# EAGLE schematic busIsolator (EAGLE 4.16)
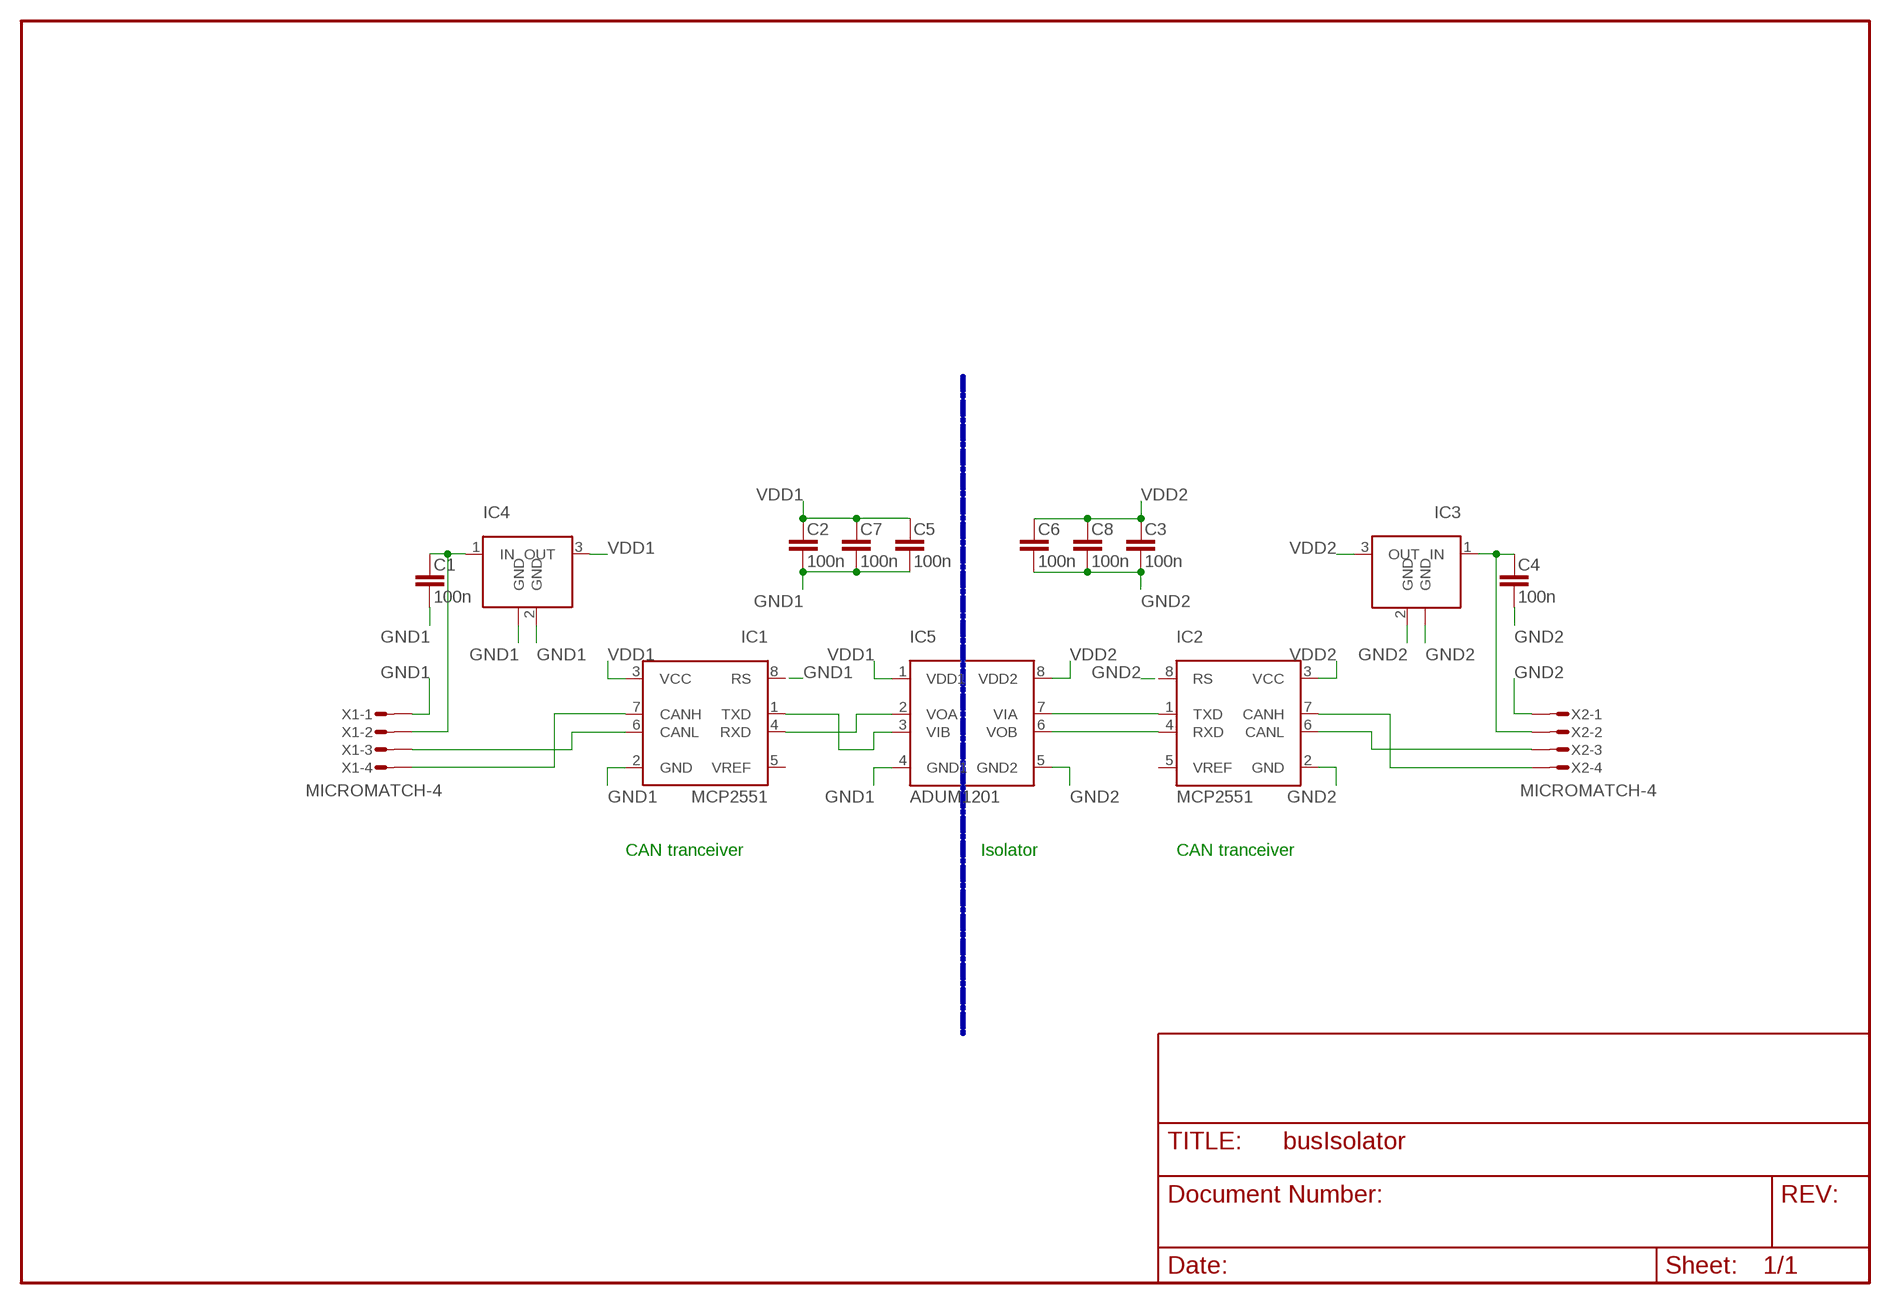
[diagram p0: schematic, sheet 1]

## Parts
C1  100n  C-EUC0603  [C0603]
C2  100n  C-EUC0603  [C0603]
C3  100n  C-EUC0603  [C0603]
C4  100n  C-EUC0603  [C0603]
C5  100n  C-EUC0603  [C0603]
C6  100n  C-EUC0603  [C0603]
C7  100n  C-EUC0603  [C0603]
C8  100n  C-EUC0603  [C0603]
IC1  MCP2551  [SOIC]
IC2  MCP2551  [SOIC]
IC3  LM340MP-5.0  [SOT223]
IC4  LM340MP-5.0  [SOT223]
IC5  ADUM1201  [SOIC]
X1  MICROMATCH-4  [MICROMATCH-4]
X2  MICROMATCH-4  [MICROMATCH-4]

## Nets
GND1: C1.2 C2.2 C5.2 C7.2 IC1.2(GND) IC1.8(RS) IC4.2(GND) IC4.4(GND) IC5.4(GND1) X1.1
GND2: C3.2 C4.2 C6.2 C8.2 IC2.2(GND) IC2.8(RS) IC3.2(GND) IC3.4(GND) IC5.5(GND2) X2.1
N$1: IC1.1(TXD) IC5.3(VIB)
N$2: IC1.4(RXD) IC5.2(VOA)
N$3: IC2.1(TXD) IC5.7(VIA)
N$4: C4.1 IC3.1(IN) X2.2
N$5: IC2.4(RXD) IC5.6(VOB)
N$6: C1.1 IC4.1(IN) X1.2
N$7: IC1.6(CANL) X1.3
N$8: IC1.7(CANH) X1.4
N$9: IC2.6(CANL) X2.3
N$10: IC2.7(CANH) X2.4
VDD1: C2.1 C5.1 C7.1 IC1.3(VCC) IC4.3(OUT) IC5.1(VDD1)
VDD2: C3.1 C6.1 C8.1 IC2.3(VCC) IC3.3(OUT) IC5.8(VDD2)
Unconnected: IC1.5(VREF) IC2.5(VREF)

## Buses
B$1

## Notes on the sheet
- CAN tranceiver | Isolator | CAN tranceiver

## Library data of the parts
C1-C8 = rcl:C-EU
IC1 IC2 = mcp2551:MCP2551
IC3 IC4 = lm340mp:LM340MP-5.0
IC5 = adum1201:ADUM1201
X1 X2 = con-amp-micromatch:MICROMATCH-4: MicroMaTch 4 7-215464-4 / 0-215464-4 Drawing Number C-215464 DDEController.pdf